# EAGLE design I2C Motor Driver (EAGLE 9.1.0)
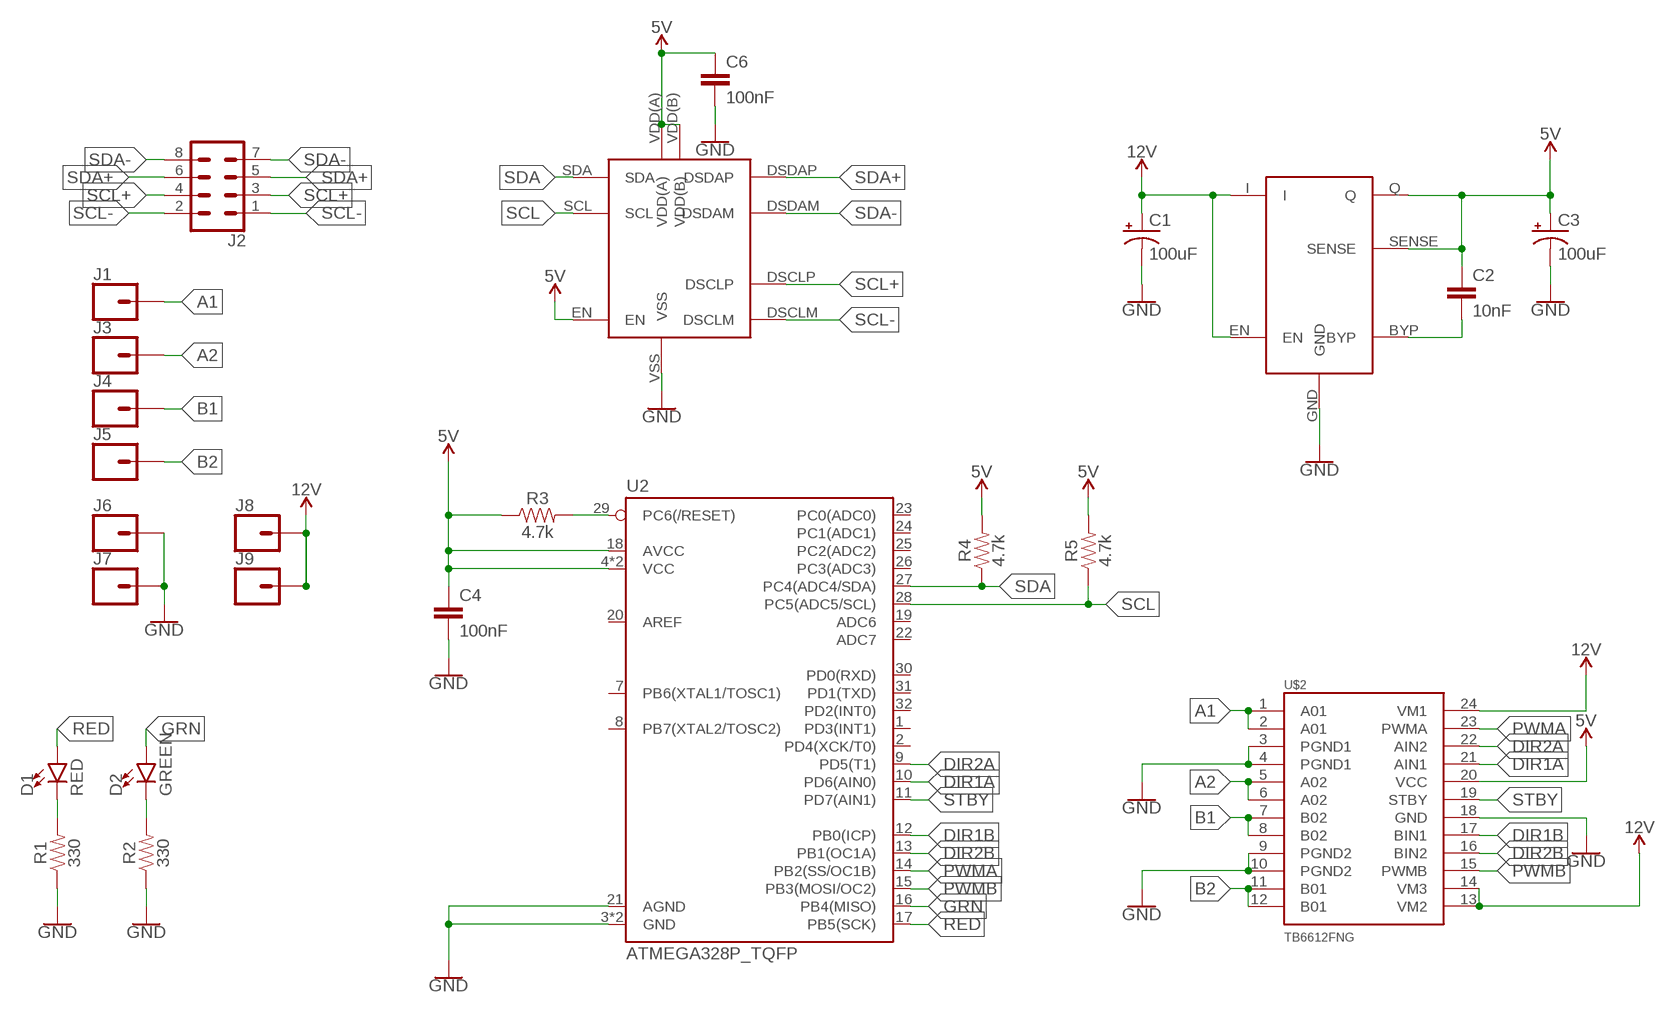
[diagram p0: schematic, sheet 1]

## Parts
C1  100uF  100UF-POLAR-RADIAL-2.5MM-25V-20%  [CPOL-RADIAL-2.5MM-6.5MM]
C2  10nF  0.1UF-0603-25V-5%  [0603]
C3  100uF  100UF-POLAR-RADIAL-2.5MM-25V-20%  [CPOL-RADIAL-2.5MM-6.5MM]
C4  100nF  0.1UF-0603-25V-5%  [0603]
C6  100nF  0.1UF-0603-25V-5%  [0603]
D1  RED  LED-RED0603  [LED-0603]
D2  GREEN  LED-GREEN0603  [LED-0603]
J1  CONN_01PTH_2MM  [1X01_2MM]
J2  CONN_04X2  [2X4]
J3  CONN_01PTH_2MM  [1X01_2MM]
J4  CONN_01PTH_2MM  [1X01_2MM]
J5  CONN_01PTH_2MM  [1X01_2MM]
J6  CONN_01PTH_2MM  [1X01_2MM]
J7  CONN_01PTH_2MM  [1X01_2MM]
J8  CONN_01PTH_2MM  [1X01_2MM]
J9  CONN_01PTH_2MM  [1X01_2MM]
R1  330  330OHM-0603-1/10W-1%  [0603]
R2  330  330OHM-0603-1/10W-1%  [0603]
R3  4.7k  4.7KOHM-0603-1/10W-1%  [0603]
R4  4.7k  4.7KOHM-0603-1/10W-1%  [0603]
R5  4.7k  4.7KOHM-0603-1/10W-1%  [0603]
U1  TLS205B0  [TLS205B0]
U2  ATMEGA328P_TQFP  [TQFP32-08]
U$1  PCA9615  [PCA9615]
U$2  TB6612FNG  [SSOP24]

## Nets
5V: C2.1 C3.1(+) C4.1 C6.1 R3.1 R4.2 R5.2 U1.Q U1.SENSE U2.4(VCC) U2.6(VCC) U2.18(AVCC) U$1.EN U$1.VDD(A) U$1.VDD(B) U$2.20(VCC)
12V: C1.1(+) J8.1 J9.1 U1.EN U1.I U$2.13(VM2) U$2.14(VM3) U$2.24(VM1)
A1: J1.1 U$2.1(A01) U$2.2(A01)
A2: J3.1 U$2.5(A02) U$2.6(A02)
B1: J4.1 U$2.7(B02) U$2.8(B02)
B2: J5.1 U$2.11(B01) U$2.12(B01)
DIR1A: U2.10(PD6(AIN0)) U$2.21(AIN1)
DIR1B: U2.12(PB0(ICP)) U$2.17(BIN1)
DIR2A: U2.9(PD5(T1)) U$2.22(AIN2)
DIR2B: U2.13(PB1(OC1A)) U$2.16(BIN2)
GND: C1.2(-) C3.2(-) C4.2 C6.2 J6.1 J7.1 R1.1 R2.1 U1.GND U2.3(GND) U2.5(GND) U2.21(AGND) U$1.VSS U$2.3(PGND1) U$2.4(PGND1) U$2.9(PGND2) U$2.10(PGND2) U$2.18(GND)
GRN: D2.A U2.16(PB4(MISO))
N$1: C2.2 U1.BYP
N$4: D2.C R2.2
N$5: D1.C R1.2
N$8: R3.2 U2.29(PC6(/RESET))
PWMA: U2.14(PB2(SS/OC1B)) U$2.23(PWMA)
PWMB: U2.15(PB3(MOSI/OC2)) U$2.15(PWMB)
RED: D1.A U2.17(PB5(SCK))
SCL: R5.1 U2.28(PC5(ADC5/SCL)) U$1.SCL
SCL+: J2.3 J2.4 U$1.DSCLP
SCL-: J2.1 J2.2 U$1.DSCLM
SDA: R4.1 U2.27(PC4(ADC4/SDA)) U$1.SDA
SDA+: J2.5 J2.6 U$1.DSDAP
SDA-: J2.7 J2.8 U$1.DSDAM
STBY: U2.11(PD7(AIN1)) U$2.19(STBY)
Unconnected: U2.1(PD3(INT1)) U2.2(PD4(XCK/T0)) U2.7(PB6(XTAL1/TOSC1)) U2.8(PB7(XTAL2/TOSC2)) U2.19(ADC6) U2.20(AREF) U2.22(ADC7) U2.23(PC0(ADC0)) U2.24(PC1(ADC1)) U2.25(PC2(ADC2)) U2.26(PC3(ADC3)) U2.30(PD0(RXD)) U2.31(PD1(TXD)) U2.32(PD2(INT0))

## Library data of the parts
C1 C3 = SparkFun-Capacitors:100UF-POLAR: 100µF polarized capacitors A capacitor is a passive two-terminal electrical component used to store electrical energy temporarily in an electric field.; PROD_ID: CAP-08439
C2 C4 C6 = SparkFun-Capacitors:0.1UF: 0.1µF ceramic capacitors A capacitor is a passive two-terminal electrical component used to store electrical energy temporarily in an electric field.; PROD_ID: CAP-08604; VALUE: 0.1uF
D1 = SparkFun-LED:LED-RED: Red SMD LED Used in manufacturing of most products at SparkFun Packages: 0603 - SMD 0603 package [Product Link] <http://docs.avagotech.com/docs/AV02-0551EN> 0603 SMART - SMD 0603 SMART package ( more efficient and expensive)[Product Link] <http://www.osram-os.com/Graphics/XPic2/00077099_0.pdf> 1206 - SMD1206 package [Product Link] <https://www.sparkfun.com/datasheets/DevTools/LilyPad/Q150OVS4.pdff> SparkFun Products: Pro Mini 328 -5V <https://www.sparkfun.com/products/821> RedBoard <https://www.sparkfun.com/products/12757> IOIO-OTG <https://www.sparkfun.com/products/13613>; PROD_ID: DIO-00819
D2 = SparkFun-LED:LED-GREEN: Green SMD LED Used in manufacturing of various products at SparkFun Packages: 0603 - SMD 0603 package [Product Link] <http://www.futureelectronics.com/en/technologies/semiconductors/optoelectronics/leds/Pages/9894312-LTST-C190GKT.aspx?CrossPart=HSMG-C190&IM=0> LilyPad 1206 - SMD1206 LilyPad package [Product Link] <http://www.futureelectronics.com/en/Technologies/Product.aspx?ProductID=IN150NGHARVATEKCORPORATION2049943&IM=0> 1206 - SMD1206 package [Product Link] <http://www.futureelectronics.com/en/technologies/semiconductors/optoelectronics/leds/Pages/8315665-LTST-C150KGKT.aspx?IM=0> 1206 Bottom Mount -SMD 1206 Bottom Mount [Product Link] <http://www.digikey.com/product-detail/en/lite-on-inc/LTST-C230KGKT/160-1456-1-ND/386854> SparkFun Products: Pro Mini 328 -5V <https://www.sparkfun.com/products/821> RedBoard <https://www.sparkfun.com/products/12757> MP3 Trigger <https://www.sparkfun.com/products/13720> Makey Makey <https://www.sparkfun.com/products/11076>; PROD_ID: DIO-00821
J1 J3-J9 = SparkFun-Connectors:CONN_01: Single connection point. Often used as Generic Header-pin footprint for 0.1 inch spaced/style header connections On any of the 0.1 inch spaced packages, you can populate with these: Break Away Headers - Straight <https://www.sparkfun.com/products/116> (PRT-00116) Break Away Male Headers - Right Angle <https://www.sparkfun.com/products/553> (PRT-00553) Female Headers <https://www.sparkfun.com/products/115> (PRT-00115) Break Away Headers - Machine Pin <https://www.sparkfun.com/products/117> (PRT-00117) Break Away Female Headers - Swiss Machine Pin <https://www.sparkfun.com/products/743> (PRT-00743) This device is also useful as a general connection point to wire up your design to another part of your project. Our various solder wires solder well into these plated through hole pads. Hook-Up Wire - Assortment (Stranded, 22 AWG) <https://www.sparkfun.com/products/11375> (PRT-11375) Hook-Up Wire - Assortment (Solid Core, 22 AWG) <https://www.sparkfun.com/products/11367> (PRT-11367) View the entire wire category on our website here <https://www.sparkfun.com/categories/141> Special notes: SMTSO-256-ET is a "flush mount" nut for a 4-40 screw. We mostly use this on specialty testbeds; it is a nice way to connect hardware to your PCB at an adjustable hieght. Also note, the SNAP packages are for using a snappable style connector. We sell a baggie of snaps and they are also used on two LilyPad designs: Snap Assortment - 30 pack (male and female) <https://www.sparkfun.com/products/11347> (DEV-11347) LilyPad Arduino SimpleSnap <https://www.sparkfun.com/products/10941> (DEV-10941) LilyPad SimpleSnap Protoboard <https://www.sparkfun.com/products/10940> (DEV-10940)
J2 = SparkFun-Connectors:CONN_04X2: Multi connection point. Often used as Generic Header-pin footprint for 0.1 inch spaced/style header connections On any of the 0.1 inch spaced packages, you can populate with these: Break Away Headers - Straight <https://www.sparkfun.com/products/116> (PRT-00116) Break Away Male Headers - Right Angle <https://www.sparkfun.com/products/553> (PRT-00553) Female Headers <https://www.sparkfun.com/products/115> (PRT-00115) Break Away Headers - Machine Pin <https://www.sparkfun.com/products/117> (PRT-00117) Break Away Female Headers - Swiss Machine Pin <https://www.sparkfun.com/products/743> (PRT-00743)
R1 R2 = SparkFun-Resistors:330OHM: 330Ω resistor A resistor is a passive two-terminal electrical component that implements electrical resistance as a circuit element. Resistors act to reduce current flow, and, at the same time, act to lower voltage levels within circuits. - Wikipedia; PROD_ID: RES-00818
R3-R5 = SparkFun-Resistors:4.7KOHM: 4.7kΩ resistor A resistor is a passive two-terminal electrical component that implements electrical resistance as a circuit element. Resistors act to reduce current flow, and, at the same time, act to lower voltage levels within circuits. - Wikipedia; PROD_ID: RES-07857
U1 = ROVLib:TLS205B0
U2 = SparkFun-IC-Microcontroller:ATMEGA328P_TQFP: Popular 328P in QFP Storefront component: ATmega328 - TQFP <https://www.sparkfun.com/products/13448> (COM-13448) Datasheet <http://www.sparkfun.com/datasheets/Components/SMD/ATMega328.pdf> SparkFun Products SparkFun RedBoard - Programmed with Arduino <https://www.sparkfun.com/products/12757> (DEV-12757) Arduino Pro Mini 328 - 5V/16MHz <https://www.sparkfun.com/products/11113> (DEV-11113) Arduino Pro Mini 328 - 3.3V/8MHz <https://www.sparkfun.com/products/11114> (DEV-11114) SparkFun OpenLog <https://www.sparkfun.com/products/13712> (DEV-13712) SparkFun MicroView - OLED Arduino Module <https://www.sparkfun.com/products/12923> (DEV-12923) SparkFun Digital Sandbox <https://www.sparkfun.com/products/12651> (DEV-12651) SparkFun PicoBoard <https://www.sparkfun.com/products/11888> (WIG-11888) Arduino Fio <https://www.sparkfun.com/products/10116> (DEV-10116) LilyPad Arduino 328 Main Board <https://www.sparkfun.com/products/13342> (DEV-13342) SparkFun RedStick <https://www.sparkfun.com/products/13741> (DEV-13741) LilyPad MP3 <https://www.sparkfun.com/products/11013> (DEV-11013) LilyPad Arduino SimpleSnap <https://www.sparkfun.com/products/10941> (DEV-10941) SparkFun Stepoko <https://www.sparkfun.com/products/13899> (ROB-13899) SparkFun Geiger Counter <https://www.sparkfun.com/products/11345> (SEN-11345) SparkFun EL Sequencer <https://www.sparkfun.com/products/12781> (COM-12781) Arduino Pro 328 - 5V/16MHz <https://www.sparkfun.com/products/10915> (DEV-10915) CryptoCape <https://www.sparkfun.com/products/12773> (DEV-12773) SparkFun IR Thermometer Evaluation Board - MLX90614 <https://www.sparkfun.com/products/10740> (SEN-10740) SparkFun RedBot Mainboard <https://www.sparkfun.com/products/12097> (ROB-12097) Arduino Pro 328 - 3.3V/8MHz <https://www.sparkfun.com/products/10914> (DEV-10914) SparkFun Block for Intel® Edison - Arduino <https://www.sparkfun.com/products/13036> (DEV-13036) SparkFun Simon Says - Surface Mount Soldering Kit <https://www.sparkfun.com/products/10935> (KIT-10935) SparkFun 7-Segment Serial Display - Red <https://www.sparkfun.com/products/11441> (COM-11441) SparkFun 7-Segment Serial Display - White <https://www.sparkfun.com/products/11629> (COM-11629) SparkFun 7-Segment Serial Display - Yellow <https://www.sparkfun.com/products/11443> (COM-11443) SparkFun 7-Segment Serial Display - Kelly Green <https://www.sparkfun.com/products/11440> (COM-11440) SparkFun 7-Segment Serial Display - Blue <https://www.sparkfun.com/products/11442> (COM-11442) SparkFun OpenSegment Serial Display - 20mm (Blue) <https://www.sparkfun.com/products/11647> (COM-11647) SparkFun OpenSegment Serial Display - 20mm (Green) <https://www.sparkfun.com/products/11646> (COM-11646) SparkFun OpenSegment Serial Display - 20mm (White) <https://www.sparkfun.com/products/11648> (COM-11648) SparkFun OpenSegment Serial Display - 20mm (Red) <https://www.sparkfun.com/products/11644> (COM-11644) SparkFun OpenSegment Serial Display - 20mm (Yellow) <https://www.sparkfun.com/products/11645> (COM-11645) SparkFun OpenSegment Shield <https://www.sparkfun.com/products/13190> (DEV-13190); PROD_ID: IC-09069
U$1 = ROVLib:PCA9615
U$2 = SparkFun-IC-Special-Function:TB6612FNG: Toshiba 1A dual motor driver IC-09363; PROD_ID: IC-09363

## Board
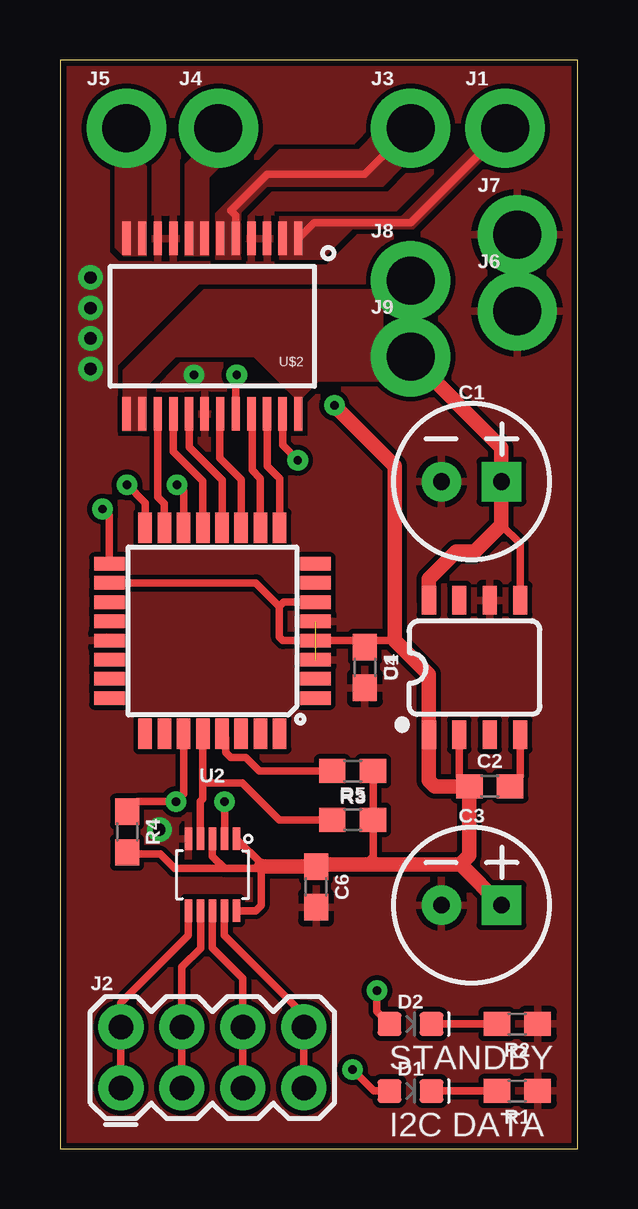
[diagram p1: board, top side]
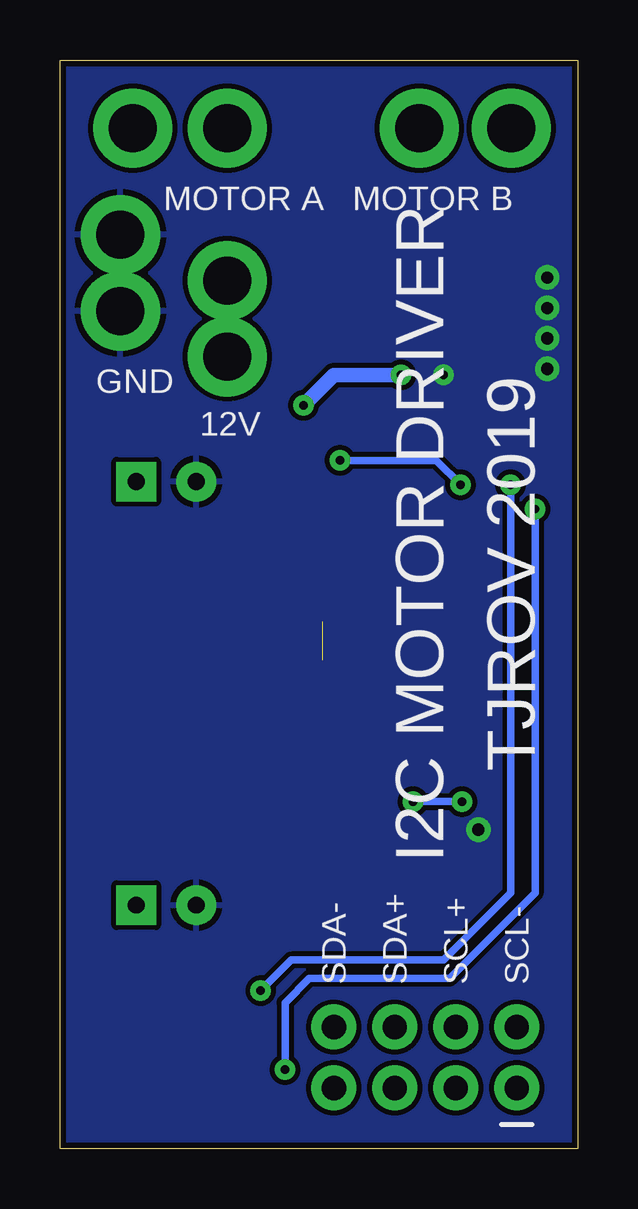
[diagram p2: board, bottom side, seen from below]

Size 21.57 x 45.39 mm. Coordinates in mm from the lower left corner, seen from the top.
Outline: 0,0 21.57,0 21.57,45.39 0,45.39 0,0
Copper layers (1*16): Top 0.035mm / dielectric 1.5mm / Bottom 0.035mm
Design rules "SparkFun": minimum track width 8mil, minimum drill 20mil, track to track 8mil, track to pad 8mil, pad to pad 8mil, via to via 8mil, smd to smd 8mil, copper to edge 10mil, drill to drill 8mil, minimum pad ring 12mil, minimum via ring 10mil, stop-mask expansion 4mil, vias tented up to drill 25mil, thermal gap 10mil

### Footprints (pad centres in the part's own frame; a part is rotated, then mirrored left to right if it is on the bottom)
CPOL-RADIAL-2.5MM-6.5MM = drill 0.7 pad 1.651 square: 1 1.25,0 | drill 0.7 pad 1.651: 2 -1.25,0
0603 = smd 1.1 x 1: 1 -0.85,0; 2 0.85,0
LED-0603 = smd 1 x 1: A -0.877,0; C 0.877,0
1X01_2MM = drill 2 pad 3.302: 1 0,0
2X4 = drill 1.016 pad 1.88: 1 -3.81,-1.27; 2 -3.81,1.27; 3 -1.27,-1.27; 4 -1.27,1.27; 5 1.27,-1.27; 6 1.27,1.27; 7 3.81,-1.27; 8 3.81,1.27
TLS205B0 = smd 0.6 x 1.2: BYP 1.905,-2.8; EN 1.905,2.8; GND 0.635,2.8; I -1.905,2.8; NC -0.635,2.8; NC2 0.635,-2.8; Q -1.905,-2.8; SENSE -0.635,-2.8
TQFP32-08 = smd 1.27 x 0.559: 1 -4.293,2.8; 2 -4.293,2; 3 -4.293,1.2; 4 -4.293,0.4; 5 -4.293,-0.4; 6 -4.293,-1.2; 7 -4.293,-2; 8 -4.293,-2.8; 17 4.293,-2.8; 18 4.293,-2; 19 4.293,-1.2; 20 4.293,-0.4; 21 4.293,0.4; 22 4.293,1.2; 23 4.293,2; 24 4.293,2.8 | smd 0.559 x 1.27: 9 -2.8,-4.293; 10 -2,-4.293; 11 -1.2,-4.293; 12 -0.4,-4.293; 13 0.4,-4.293; 14 1.2,-4.293; 15 2,-4.293; 16 2.8,-4.293; 25 2.8,4.293; 26 2,4.293; 27 1.2,4.293; 28 0.4,4.293; 29 -0.4,4.293; 30 -1.2,4.293; 31 -2,4.293; 32 -2.8,4.293
PCA9615 = smd 0.95 x 0.3: DSCLM 1.5,-1; DSCLP 1.5,-0.5; DSDAM 1.5,0.5; DSDAP 1.5,0; EN -1.5,0; SCL -1.5,-0.5; SDA -1.5,0.5; VDD(A) -1.5,1; VDD(B) 1.5,1; VSS -1.5,-1
SSOP24 = smd 0.348 x 1.397: 1 -3.575,-3.656; 2 -2.925,-3.656; 3 -2.275,-3.656; 4 -1.625,-3.656; 5 -0.975,-3.656; 6 -0.325,-3.656; 7 0.325,-3.656; 8 0.975,-3.656; 9 1.625,-3.656; 10 2.275,-3.656; 11 2.925,-3.656; 12 3.575,-3.656; 13 3.575,3.656; 14 2.925,3.656; 15 2.275,3.656; 16 1.625,3.656; 17 0.975,3.656; 18 0.325,3.656; 19 -0.325,3.656; 20 -0.975,3.656; 21 -1.625,3.656; 22 -2.275,3.656; 23 -2.925,3.656; 24 -3.575,3.656

### Placement (x,y rotation side)
C1  17.14,27.81 0 top
C2  17.91,15.11 0 top
C3  17.14,10.16 0 top
C4  12.7,20.07 270 top
C6  10.67,10.92 270 top
D1  14.61,2.41 0 top
D2  14.61,5.21 0 top
J1  18.54,42.55 0 top
J2  6.35,3.81 0 top
J3  14.61,42.55 0 top
J4  6.6,42.55 0 top
J5  2.77,42.55 0 top
J6  19.05,34.92 0 top
J7  19.05,38.1 0 top
J8  14.61,36.2 0 top
J9  14.61,33.02 0 top
R1  19.05,2.41 180 top
R2  19.05,5.21 180 top
R3  12.19,15.75 180 top
R4  2.79,13.21 270 top
R5  12.19,13.72 0 top
U1  17.27,20.07 0 top
U2  6.35,21.59 180 top
U$1  6.35,11.43 270 top
U$2  6.35,34.29 180 top

### Tracks (layer width: path | path; a pad name or v marks a point on that pad's centre or on a via)
5V  (via drill 0.35)
  Top 0.305: U1.SENSE 16.64,15.53 C2.1 | U$1.VDD(A) 8.43,11.85 8.38,11.8 8.38,11.68 | 8.38,11.68 8.38,10.16 8.15,9.93 U$1.VDD(B) | U$1.EN 6.35,12.19 6.86,11.68 | 6.86,11.68 8.38,11.68 | 16.7,11.85 16.68,11.85 | U$2.20 7.33,32.22 v7.37,32.26 | 13.95,21.19 12.7,21.19 | 12.7,21.19 U2.4 9.29,21.19 9.14,21.34 9.14,22.61 | 9.14,22.61 9.33,22.79 U2.6 | U2.18 8.16,23.59 9.14,22.61 | C4.1 12.7,21.19 | R3.1 R5.2 13.04,12.19 12.7,11.85 | 6.86,11.68 4.78,11.68 4.17,12.29 2.86,12.29 R4.2
  Top 0.61: 16.68,11.85 17.06,12.23 C2.1 15.62,15.11 15.37,15.37 U1.Q 15.37,19.77 13.95,21.19 13.95,28.47 v11.43,30.99 | C3.1 16.7,11.85 12.7,11.85 10.75,11.85 C6.1 8.41,11.77 8.38,11.8
  Bottom 0.61: v7.37,32.26 10.16,32.26 v11.43,30.99
12V
  Top 0.305: U1.EN 19.18,25.23 18.39,26.02
  Top 0.61: 18.39,29.23 18.39,29.21 | 18.39,29.21 C1.1 18.39,26.02 17.27,24.89 16.51,24.89 15.37,23.75 U1.I | J9.1 18.39,29.23 | 18.39,29.23 18.39,29.21
  Top 0.635: J8.1 J9.1
  pour Top (no thermals): 2.62,29.95 3.58,29.95 3.61,29.92 3.61,31.8 4.83,33.02 8.08,33.02 9.75,31.34 9.75,29.95 10.11,29.95 10.11,31.34 10.77,32 13.46,32 13.46,35.81 5.99,35.81 2.62,32.44
A1
  Top 0.305: J1.1 14.61,38.61 10.59,38.61 U$2.1
  pour Top (isolate 0.254, no thermals): 9.14,37.08 10.92,37.08 12.19,38.35 14.73,38.35 18.03,41.66 17.53,42.16 14.22,38.86 9.14,38.86
A2
  Top 0.305: U$2.5 7.33,38.9 7.11,39.12 8.64,40.64 12.7,40.64 J3.1
  pour Top (isolate 0.254, no thermals): 6.48,37.08 7.54,37.08 7.54,39.04 8.13,39.62 8.64,40.13 13.46,40.13 14.22,40.89 14.22,41.91 13.72,42.42 13.46,42.42 13.21,42.42 12.45,41.66 9.14,41.66 6.48,38.99
B1
  pour Top (no thermals): 5.21,37.24 6.22,37.24 6.22,40.51 7.37,41.66 6.6,42.42 5.21,41.02
B2
  pour Top (no thermals): 2.62,37.26 2.64,37.24 3.61,37.24 3.61,40.94 3.12,41.43 2.31,41.43 2.29,41.4 2.29,37.59
DIR1A
  Top 0.305: U$2.21 8,30.61 8,28.3 8.35,27.95 U2.10
DIR1B
  Top 0.305: U$2.17 5.38,29.25 6.75,27.87 U2.12
DIR2A
  Top 0.305: U$2.22 8.62,28.46 9.15,27.93 U2.9
DIR2B
  Top 0.305: U$2.16 4.72,29.06 5.95,27.83 U2.13
GND  (via drill 0.35, 0.51)  (1 unrouted)
  other vias: 5.59,32.26 1.27,32.51 1.27,33.78 1.27,35.05 1.27,36.32 4.14,13.31
  pour Bottom: -6.69,52.58 27.3,52.58 27.3,-5.08 -6.02,-5.08
  pour Top (rank 6): -6.6,49.28 26.16,49.28 26.16,-2.29 -8.38,-2.29 -8.38,47.5
GRN  (via drill 0.35)
  Top 0.305: v2.79,27.69 3.55,26.93 U2.16 | v13.21,6.6 13.21,5.73 D2.A
  Bottom 0.305: v2.79,27.69 2.79,10.67 5.59,7.87 11.94,7.87 v13.21,6.6
N$1
  Top 0.305: U1.BYP 19.18,15.53 C2.2
N$4
  Top 0.305: D2.C R2.2
N$5
  Top 0.305: D1.C R1.2
N$8
  Top 0.305: R3.2 8.3,15.75 7.74,16.31 7.12,16.31 6.92,16.52 6.92,17.13 U2.29
PWMA  (via drill 0.35)
  Top 0.305: v4.88,27.69 5.15,27.41 U2.14 | v9.91,28.7 9.28,29.33 U$2.23
  Bottom 0.305: v4.88,27.69 5.89,28.7 v9.91,28.7
PWMB
  Top 0.305: U$2.15 4.08,27.17 4.35,26.89 U2.15
RED  (via drill 0.35)
  Top 0.305: v1.78,26.67 2.06,26.39 U2.17 | v12.19,3.3 13.08,2.41 D1.A
  Bottom 0.305: v1.78,26.67 1.78,10.67 5.33,7.11 11.18,7.11 12.19,6.1 v12.19,3.3
SCL
  Top 0.305: U$1.SCL 5.84,14.48 5.95,14.59 5.95,15.24 5.95,15.26 | U2.28 5.95,15.26 | R5.1 9.14,13.72 7.6,15.26 5.95,15.26
SCL+
  Top 0.305: J2.3 J2.4 5.08,7.59 5.86,8.37 U$1.DSCLP
SCL-
  Top 0.305: J2.1 J2.2 2.54,6.1 5.35,8.91 U$1.DSCLM
SDA  (via drill 0.35)
  Top 0.305: U$1.SDA v6.86,14.48 | U2.27 5.15,14.8 v4.83,14.48 3.21,14.48 R4.1
  Bottom 0.305: v6.86,14.48 v4.83,14.48
SDA+
  Top 0.305: U$1.DSDAP 6.35,8.38 7.62,7.11 J2.6 J2.5
SDA-
  Top 0.305: J2.7 J2.8 10.16,5.59 6.85,8.9 U$1.DSDAM
STBY
  Top 0.305: U$2.19 6.66,30.61 6.66,28.8 7.55,27.91 U2.11

### Text on the board
tPlace: STANDBY | I2C DATA
bPlace: MOTOR B | MOTOR A | GND | 12V | TJROV 2019 | I2C MOTOR DRIVER | SCL- | SCL+ | SDA+ | SDA-